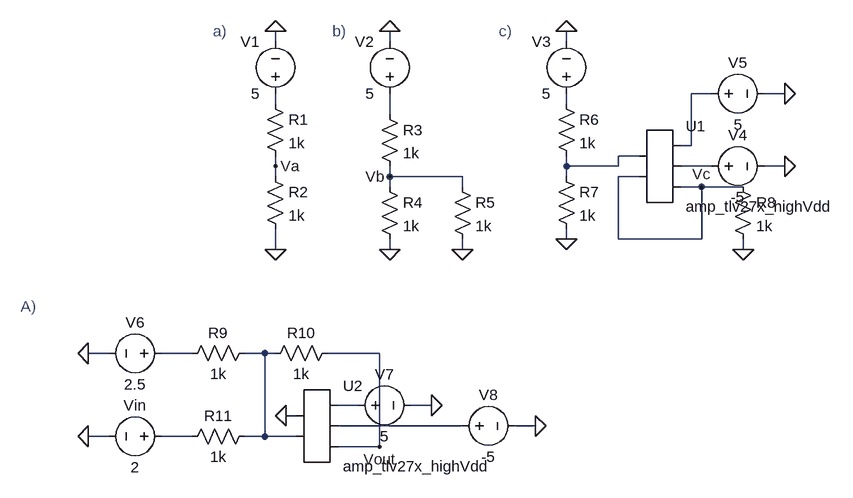
[diagram p0: schematic Lab6.asc]
Lab6.asc, the LTspice schematic file:
Version 4
SHEET 1 1700 1464
WIRE 48 16 48 0
WIRE 224 16 224 0
WIRE 496 16 496 0
WIRE 720 96 688 96
WIRE 832 96 800 96
WIRE 48 112 48 96
WIRE 496 112 496 96
WIRE 224 128 224 96
WIRE 688 176 688 96
WIRE 688 176 672 176
WIRE 608 192 576 192
WIRE 48 208 48 192
WIRE 496 208 496 192
WIRE 576 208 576 192
WIRE 576 208 496 208
WIRE 720 208 672 208
WIRE 832 208 800 208
WIRE 48 224 48 208
WIRE 224 224 224 208
WIRE 336 224 224 224
WIRE 496 224 496 208
WIRE 608 224 576 224
WIRE 224 240 224 224
WIRE 336 240 336 224
WIRE 704 240 672 240
WIRE 768 240 704 240
WIRE 496 320 496 304
WIRE 576 320 576 224
WIRE 704 320 704 240
WIRE 704 320 576 320
WIRE 48 336 48 304
WIRE 224 336 224 320
WIRE 336 336 336 320
WIRE 768 336 768 320
WIRE -208 496 -240 496
WIRE -80 496 -128 496
WIRE 32 496 0 496
WIRE 48 496 32 496
WIRE 208 496 128 496
WIRE 176 576 144 576
WIRE 288 576 256 576
WIRE 80 592 64 592
WIRE 336 608 144 608
WIRE 448 608 416 608
WIRE -208 624 -240 624
WIRE -80 624 -128 624
WIRE 32 624 32 496
WIRE 32 624 0 624
WIRE 80 624 32 624
WIRE 208 640 208 496
WIRE 208 640 144 640
FLAG 48 0 0
FLAG 48 208 Va
FLAG 48 336 0
FLAG 224 0 0
FLAG 224 336 0
FLAG 336 336 0
FLAG 224 224 Vb
FLAG 496 0 0
FLAG 496 320 0
FLAG 768 336 0
FLAG 704 240 Vc
FLAG 832 96 0
FLAG 832 208 0
FLAG -240 496 0
FLAG -240 624 0
FLAG 64 592 0
FLAG 208 640 Vout
FLAG 288 576 0
FLAG 448 608 0
SYMBOL voltage 48 112 R180
WINDOW 0 24 96 Left 2
WINDOW 3 24 16 Left 2
SYMATTR InstName V1
SYMATTR Value 5
SYMBOL res 32 96 R0
SYMATTR InstName R1
SYMATTR Value 1k
SYMBOL res 32 208 R0
SYMATTR InstName R2
SYMATTR Value 1k
SYMBOL voltage 224 112 R180
WINDOW 0 24 96 Left 2
WINDOW 3 24 16 Left 2
SYMATTR InstName V2
SYMATTR Value 5
SYMBOL res 208 112 R0
SYMATTR InstName R3
SYMATTR Value 1k
SYMBOL res 208 224 R0
SYMATTR InstName R4
SYMATTR Value 1k
SYMBOL res 320 224 R0
SYMATTR InstName R5
SYMATTR Value 1k
SYMBOL voltage 496 112 R180
WINDOW 0 24 96 Left 2
WINDOW 3 24 16 Left 2
SYMATTR InstName V3
SYMATTR Value 5
SYMBOL res 480 96 R0
SYMATTR InstName R6
SYMATTR Value 1k
SYMBOL res 480 208 R0
SYMATTR InstName R7
SYMATTR Value 1k
SYMBOL AutoGenerated\\amp_tlv27x_highVdd 640 208 R0
SYMATTR InstName U1
SYMBOL res 752 224 R0
SYMATTR InstName R8
SYMATTR Value 1k
SYMBOL voltage 704 208 R270
WINDOW 0 32 56 VTop 2
WINDOW 3 -32 56 VBottom 2
SYMATTR InstName V4
SYMATTR Value -5
SYMBOL voltage 704 96 R270
WINDOW 0 32 56 VTop 2
WINDOW 3 -32 56 VBottom 2
SYMATTR InstName V5
SYMATTR Value 5
SYMBOL voltage -112 496 R90
WINDOW 0 -32 56 VBottom 2
WINDOW 3 32 56 VTop 2
SYMATTR InstName V6
SYMATTR Value 2.5
SYMBOL res 16 480 R90
WINDOW 0 0 56 VBottom 2
WINDOW 3 32 56 VTop 2
SYMATTR InstName R9
SYMATTR Value 1k
SYMBOL res 144 480 R90
WINDOW 0 0 56 VBottom 2
WINDOW 3 32 56 VTop 2
SYMATTR InstName R10
SYMATTR Value 1k
SYMBOL voltage -112 624 R90
WINDOW 0 -32 56 VBottom 2
WINDOW 3 32 56 VTop 2
WINDOW 123 0 0 Left 0
WINDOW 39 0 0 Left 0
SYMATTR InstName Vin
SYMATTR Value 2
SYMBOL res 16 608 R90
WINDOW 0 0 56 VBottom 2
WINDOW 3 32 56 VTop 2
SYMATTR InstName R11
SYMATTR Value 1k
SYMBOL AutoGenerated\\amp_tlv27x_highVdd 112 608 R0
SYMATTR InstName U2
SYMBOL voltage 160 576 R270
WINDOW 0 32 56 VTop 2
WINDOW 3 -32 56 VBottom 2
SYMATTR InstName V7
SYMATTR Value 5
SYMBOL voltage 320 608 R270
WINDOW 0 32 56 VTop 2
WINDOW 3 -32 56 VBottom 2
SYMATTR InstName V8
SYMATTR Value -5
TEXT -48 0 Left 2 ;a)
TEXT 136 0 Left 2 ;b)
TEXT 392 0 Left 2 ;c)
TEXT -344 424 Left 2 ;A)

The netlist it stands for:
* Lab6.asc
V1 N002 0 5
R1 N002 Va 1k
R2 Va 0 1k
V2 N004 0 5
R3 N004 Vb 1k
R4 Vb 0 1k
R5 Vb 0 1k
V3 N003 0 5
R6 N003 N005 1k
R7 N005 0 1k
* U1: amp_tlv27x_highVdd (symbol AutoGenerated\amp_tlv27x_highVdd not available, pins judged from their places): pin1=N005 pin2=Vc pin3=N001 pin4=N006 pin5=Vc
R8 Vc 0 1k
V4 N006 0 -5
V5 N001 0 5
V6 N007 0 2.5
R9 N008 N007 1k
R10 Vout N008 1k
Vin N011 0 2
R11 N008 N011 1k
* U2: amp_tlv27x_highVdd (symbol AutoGenerated\amp_tlv27x_highVdd not available, pins judged from their places): pin1=0 pin2=N008 pin3=N009 pin4=N010 pin5=Vout
V7 N009 0 5
V8 N010 0 -5
* a)
* b)
* c)
* A)
.backanno
.end